# Altium project LED.PrjPCB
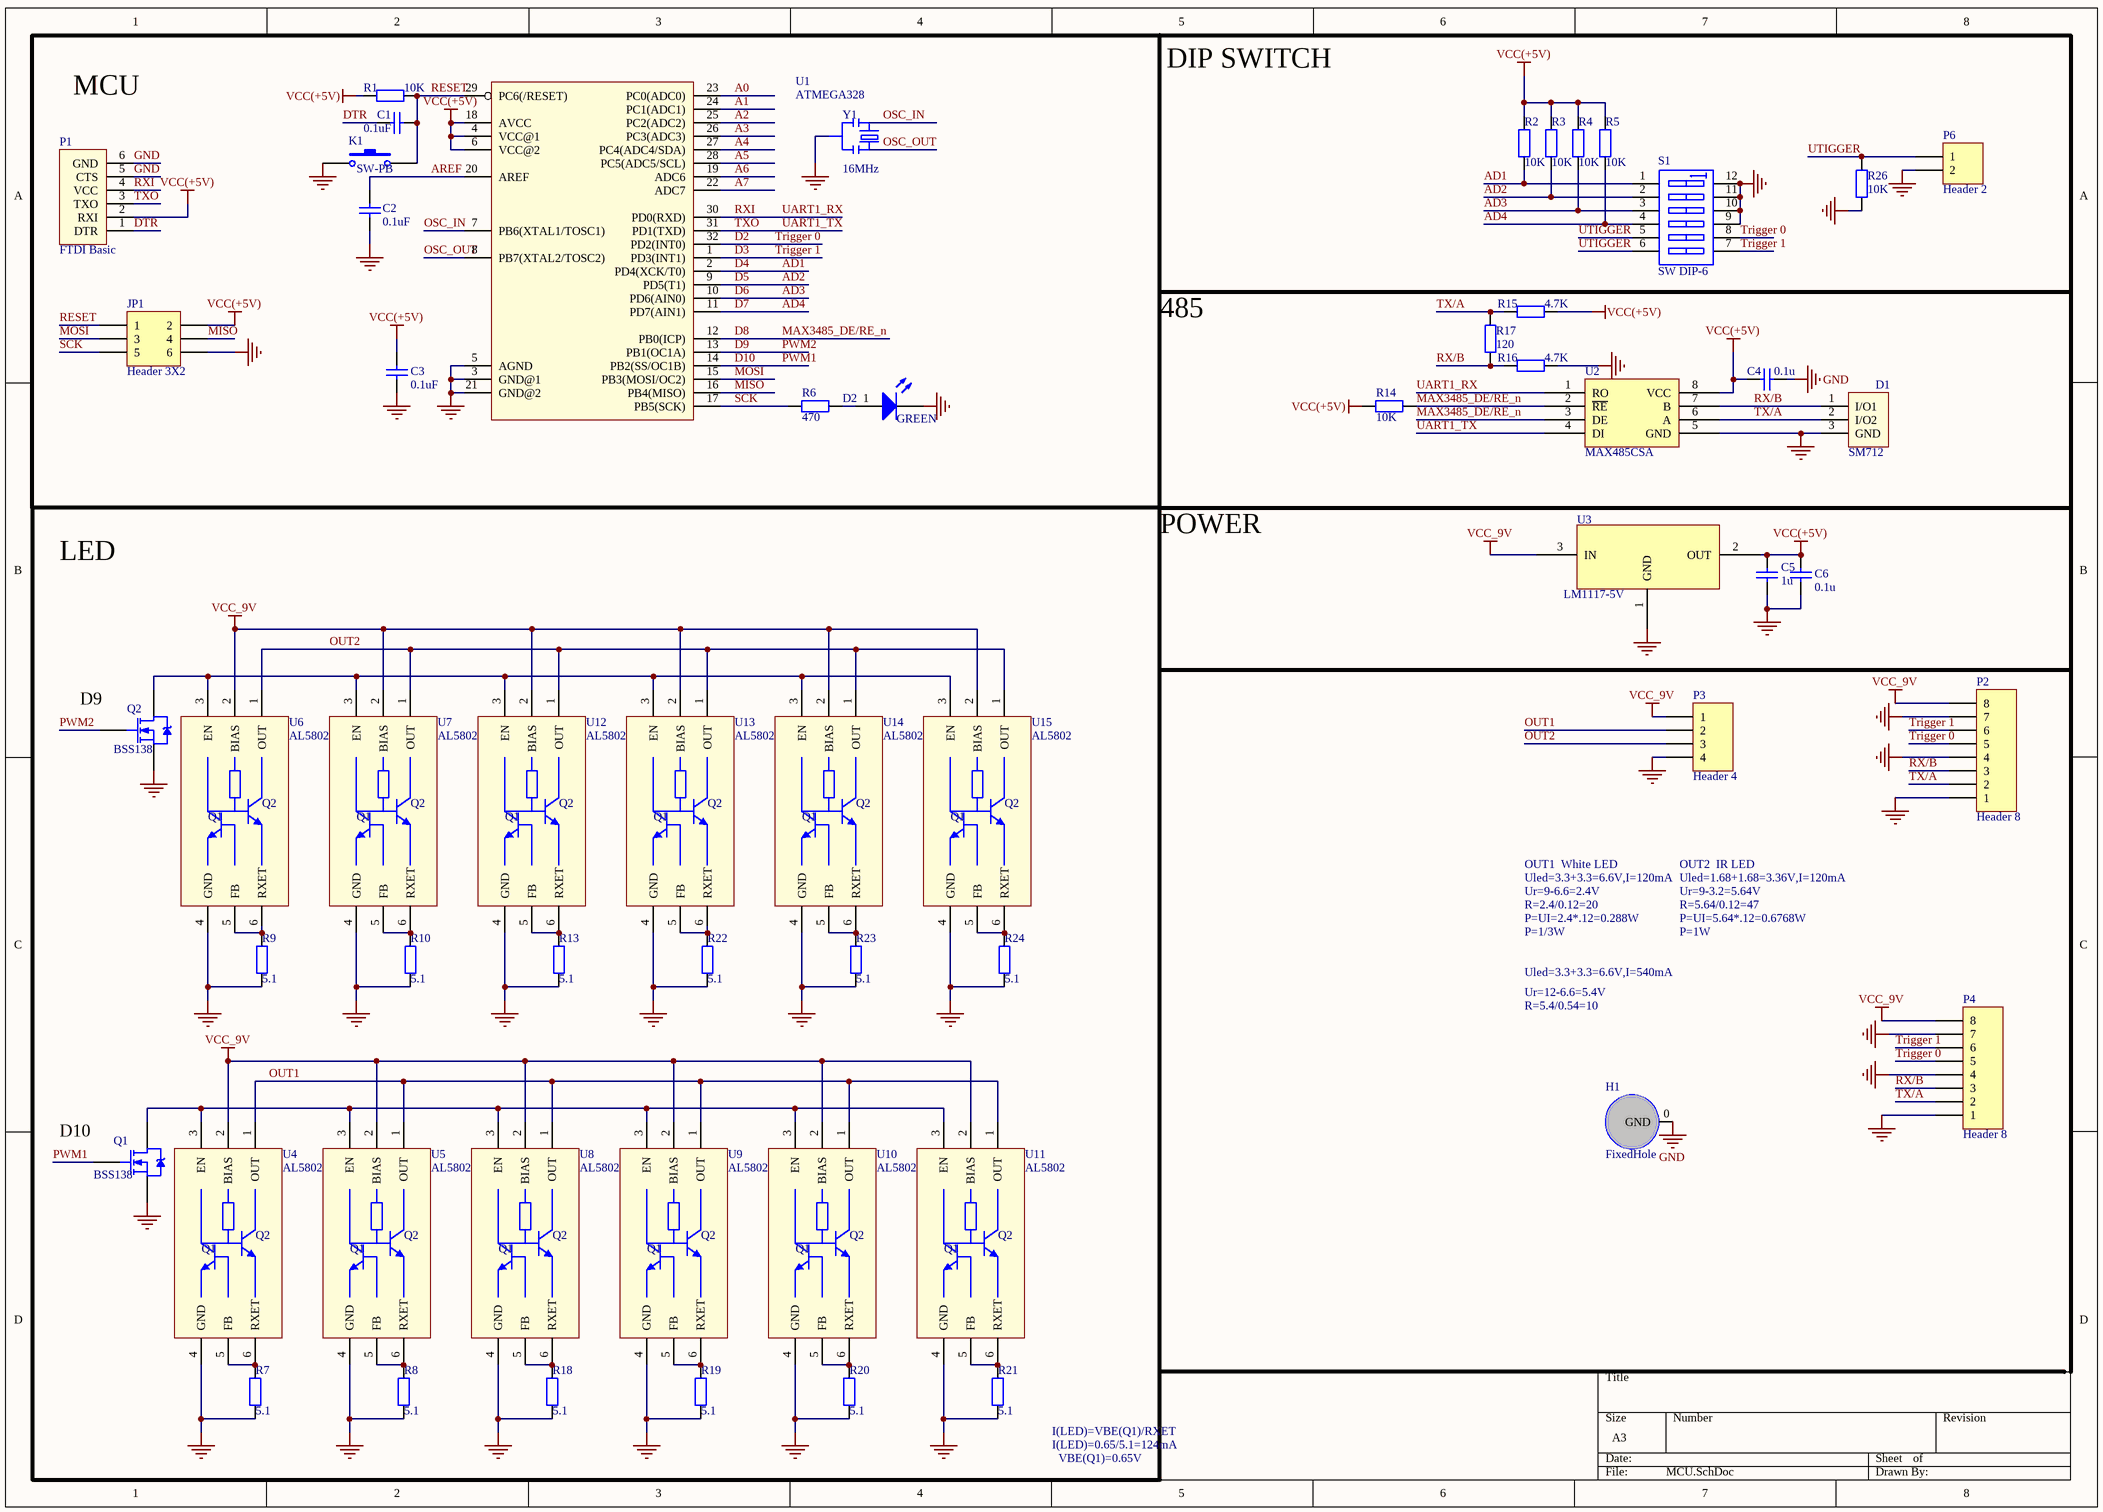
[diagram p0: MCU.SchDoc]
2 sheets, 63 parts. Net scope: global (net labels, ports and power ports of the same name join across sheets).
Board file: UC-428.pcbdoc
Sheets:
  MCU.SchDoc
  connect.SchDoc

## Sheet MCU.SchDoc
size A3

### Parts
C1  0.1uF  [C0603]
C2  0.1uF  [C0603]
C3  0.1uF  [C0603]
C4  0.1u  [C0603]
C5  1u  [C0603]
C6  0.1u  [C0603]
D1  SM712  [SOT23-3]
D2  GREEN  [LED0805]
H1  FixedHole  [固定孔_1]
JP1  Header 3X2  [MHDR1X6]
K1  SW-PB  [157SW]
P1  FTDI Basic  [MHDR1X6]
P2  Header 8  [SH_1.25MM*8]
P3  Header 4  [SMT_1.25MM*4]
P4  Header 8  [SH_1.25MM*8]
P6  Header 2  [HDR1X2]
Q1  BSS138  [SOT-23 (Standard)]
Q2  BSS138  [SOT-23 (Standard)]
R1  10K  [R0603]
R2  10K  [R0603]
R3  10K  [R0603]
R4  10K  [R0603]
R5  10K  [R0603]
R6  470  [R0603]
R7  5.1  [R0603]
R8  5.1  [R0603]
R9  5.1  [R0603]
R10  5.1  [R0603]
R13  5.1  [R0603]
R14  10K  [R0603]
R15  4.7K  [R0603]
R16  4.7K  [R0603]
R17  120  [R0603]
R18  5.1  [R0603]
R19  5.1  [R0603]
R20  5.1  [R0603]
R21  5.1  [R0603]
R22  5.1  [R0603]
R23  5.1  [R0603]
R24  5.1  [R0603]
R26  10K  [R0603]
S1  SW DIP-6  [DIP_SW_6WAY_SMD]
U1  ATMEGA328  [TQFP32-08]
U2  MAX485CSA  [SOIC-8]
U3  LM1117-5V  [SOT-223]
U4  AL5802  [SOT26]
U5  AL5802  [SOT26]
U6  AL5802  [SOT26]
U7  AL5802  [SOT26]
U8  AL5802  [SOT26]
U9  AL5802  [SOT26]
U10  AL5802  [SOT26]
U11  AL5802  [SOT26]
U12  AL5802  [SOT26]
U13  AL5802  [SOT26]
U14  AL5802  [SOT26]
U15  AL5802  [SOT26]
Y1  16MHz  [RESONATOR-SMD]

### Blocks framed on the sheet
LED: Q1 Q2 R7-R10 R13 R18-R24 U4-U15

### Nets
GND: C2.1 C3.2 C4.1 C5.1 C6.2 D1.3(GND) D2.2(K) H1.0(GND) JP1.6 K1.1 P1.5(CTS) P1.6(GND) P2.1 P2.4 P2.7 P3.4 P4.1 P4.4 P4.7 P6.2 Q1.S Q2.S R7.2 R8.2 R9.2 R10.2 R13.2 R16.1 R18.2 R19.2 R20.2 R21.2 R22.2 R23.2 R24.2 R26.1 S1.9(B4) S1.10(B3) S1.11(B2) S1.12(B1) U1.3(GND@1) U1.5(AGND) U1.21(GND@2) U2.5(GND) U3.1(GND) U4.4(GND) U5.4(GND) U6.4(GND) U7.4(GND) U8.4(GND) U9.4(GND) U10.4(GND) U11.4(GND) U12.4(GND) U13.4(GND) U14.4(GND) U15.4(GND) Y1.2
VCC(+5V): C3.1 C4.2 C5.2 C6.1 JP1.2 P1.2(RXI) R1.1 R2.1 R3.1 R4.1 R5.1 R14.2 R15.1 U1.4(VCC@1) U1.6(VCC@2) U1.18(AVCC) U2.8(VCC) U3.2(OUT)
VCC_9V: P2.8 P3.1 P4.8 U3.3(IN) U4.2(BIAS) U5.2(BIAS) U6.2(BIAS) U7.2(BIAS) U8.2(BIAS) U9.2(BIAS) U10.2(BIAS) U11.2(BIAS) U12.2(BIAS) U13.2(BIAS) U14.2(BIAS) U15.2(BIAS)
A0: U1.23(PC0(ADC0))
A1: U1.24(PC1(ADC1))
A2: U1.25(PC2(ADC2))
A3: U1.26(PC3(ADC3))
A4: U1.27(PC4(ADC4/SDA))
A5: U1.28(PC5(ADC5/SCL))
A6: U1.19(ADC6)
A7: U1.22(ADC7)
AD1: R2.2 S1.1(A1) U1.2(PD4(XCK/T0))  [also labelled D4]
AD2: R3.2 S1.2(A2) U1.9(PD5(T1))  [also labelled D5]
AD3: R4.2 S1.3(A3) U1.10(PD6(AIN0))  [also labelled D6]
AD4: R5.2 S1.4(A4) U1.11(PD7(AIN1))  [also labelled D7]
AREF: C2.2 U1.20(AREF)
D2: P2.5 P4.5 S1.8(B5) U1.32(PD2(INT0))  [also labelled Trigger 0]
D3: P2.6 P4.6 S1.7(B6) U1.1(PD3(INT1))  [also labelled Trigger 1]
D8: R14.1 U1.12(PB0(ICP)) U2.2(~{RE}) U2.3(DE)  [also labelled MAX3485_DE/RE_n]
D9: Q2.G U1.13(PB1(OC1A))  [also labelled PWM2]
D10: Q1.G U1.14(PB2(SS/OC1B))  [also labelled PWM1]
DTR: C1.1 P1.1(DTR)
MISO: JP1.4 U1.16(PB4(MISO))
MOSI: JP1.3 U1.15(PB3(MOSI/OC2))
OSC_IN: U1.7(PB6(XTAL1/TOSC1)) Y1.3
OSC_OUT: U1.8(PB7(XTAL2/TOSC2)) Y1.1
OUT1: P3.2 U4.1(OUT) U5.1(OUT) U8.1(OUT) U9.1(OUT) U10.1(OUT) U11.1(OUT)
OUT2: P3.3 U6.1(OUT) U7.1(OUT) U12.1(OUT) U13.1(OUT) U14.1(OUT) U15.1(OUT)
RESET: C1.2 JP1.1 K1.2 R1.2 U1.29(PC6(/RESET))
RX/B: D1.1(I/O1) P2.3 P4.3 R16.2 R17.2 U2.7(B)
RXI: P1.4(VCC) U1.30(PD0(RXD)) U2.1(RO)  [also labelled UART1_RX]
SCK: JP1.5 R6.1 U1.17(PB5(SCK))
TX/A: D1.2(I/O2) P2.2 P4.2 R15.2 R17.1 U2.6(A)
TXO: P1.3(TXO) U1.31(PD1(TXD)) U2.4(DI)  [also labelled UART1_TX]
UTIGGER: P6.1 R26.2 S1.5(A5) S1.6(A6)
NetD2_1: D2.1(A) R6.2
NetQ1_D: Q1.D U4.3(EN) U5.3(EN) U8.3(EN) U9.3(EN) U10.3(EN) U11.3(EN)
NetQ2_D: Q2.D U6.3(EN) U7.3(EN) U12.3(EN) U13.3(EN) U14.3(EN) U15.3(EN)
NetR7_1: R7.1 U4.5(FB) U4.6(RXET)
NetR8_1: R8.1 U5.5(FB) U5.6(RXET)
NetR9_1: R9.1 U6.5(FB) U6.6(RXET)
NetR10_1: R10.1 U7.5(FB) U7.6(RXET)
NetR13_1: R13.1 U12.5(FB) U12.6(RXET)
NetR18_1: R18.1 U8.5(FB) U8.6(RXET)
NetR19_1: R19.1 U9.5(FB) U9.6(RXET)
NetR20_1: R20.1 U10.5(FB) U10.6(RXET)
NetR21_1: R21.1 U11.5(FB) U11.6(RXET)
NetR22_1: R22.1 U13.5(FB) U13.6(RXET)
NetR23_1: R23.1 U14.5(FB) U14.6(RXET)
NetR24_1: R24.1 U15.5(FB) U15.6(RXET)

### Notes on the sheet
- MCU
- DIP SWITCH
- 485
- POWER
- (near Q2) D9
- Uled=3.3+3.3=6.6V,I=120mA
- OUT1  White LED
- R=2.4/0.12=20
- P=UI=2.4*.12=0.288W
- Ur=9-6.6=2.4V
- Uled=1.68+1.68=3.36V,I=120mA
- OUT2  IR LED
- R=5.64/0.12=47
- P=UI=5.64*.12=0.6768W
- Ur=9-3.2=5.64V
- P=1/3W
- Uled=3.3+3.3=6.6V,I=540mA
- Ur=12-6.6=5.4V
- P=1W
- R=5.4/0.54=10
- (near Q1) D10
- I(LED)=VBE(Q1)/RXET
- I(LED)=0.65/5.1=124mA
- VBE(Q1)=0.65V
- (in symbol AL5802) Q2; Q1

### Library data of the parts
C1-C3 = CAP SMT C100nF25V10%X7R: Capacitor; Voltage: 25V; iPartNumber: C100nF25V10%X7R; Value: 0.1uF
C4 = Cap: Capacitor; Value: 100pF; Published: 8-Jun-2000; LatestRevisionDate: 17-Jul-2002; LatestRevisionNote: Re-released for DXP Platform.; PackageReference: RAD-0.3; Publisher: Altium Limited
C5 = Cap: 50V/8.2u/0805; Value: 100n; Published: 8-Jun-2000; LatestRevisionDate: 17-Jul-2002; LatestRevisionNote: Re-released for DXP Platform.; PackageReference: RAD-0.3; Publisher: Altium Limited
C6 = CAP0805: Capacitor; Value: 104; Published: 8-Jun-2000; Revision: July-2002: Re-released for DXP Platform.; Publisher: Altium Limited
D2 = LED0: Typical INFRARED GaAs LED; Published: 8-Jun-2000; LatestRevisionDate: 08-Jul-2005; LatestRevisionNote: Mech Layer 1 removed.; PackageReference: LED-0; Publisher: Altium Limited
H1 = 固定孔
JP1 = Header 3X2: Header, 3-Pin, Dual row; LatestRevisionDate: 17-Jul-2002; LatestRevisionNote: Re-released for DXP Platform.; Publisher: Altium Limited
K1 = SW-PB: Switch; Published: 24-Mar-1999; LatestRevisionDate: 17-Jul-2002; LatestRevisionNote: Re-released for DXP Platform.; PackageReference: SPST-2; Publisher: Altium Limited; PackageDescription: Switch; 2 Leads
P1 = ARDUINO_SERIAL_PROGRAMPTH
P2 P4 = Header 8: Header, 8-Pin; LatestRevisionDate: 17-Jul-2002; LatestRevisionNote: Re-released for DXP Platform.; Publisher: Altium Limited
P3 = Header 4: Header, 4-Pin; LatestRevisionDate: 17-Jul-2002; LatestRevisionNote: Re-released for DXP Platform.; Publisher: Altium Limited
P6 = Header 2: Header, 2-Pin; LatestRevisionDate: 17-Jul-2002; LatestRevisionNote: Re-released for DXP Platform.; Publisher: Altium Limited
Q1 Q2 = NMOS: Manufacturer: Fairchild Semiconductor; Manufacturer Part Number: BSS123; FET Type: MOSFET N-Channel, Metal Oxide; FET Feature: Logic Level Gate; Drain to Source Voltage (Vdss): 100V; Current - Continuous Drain (Id) @ 25°C: 170mA (Ta); Rds On (Max) @ Id, Vgs: 6 Ohm @ 170mA, 10V; Vgs(th) (Max) @ Id: 2V @ 1mA; Gate Charge (Qg) @ Vgs: 2.5nC @ 10V; Input Capacitance (Ciss) @ Vds: 73pF @ 25V; Power - Max: 360mW; Supplier 1: Digi-Key; Supplier Part Number 1: BSS123NCT-ND; RoHS: RoHS Compliant; Category: Discrete Semiconductor Products; Stock 1: 163946; Pricing 1: 1=0.24, 10=0.216, 25=0.1556, 100=0.1211, 250=0.07612, 500=0.06484, 1000=0.04418 (USD); Packaging: Cut Tape (CT); Mounting Type: Surface Mount; Package / Case: TO-236-3, SC-59, SOT-23-3; Supplier Device Package: SOT-23; ComponentLink1URL: http://www.fairchildsemi.com/datasheets/BS/BSS123.pdf; ComponentLink1Description: http://www.fairchildsemi.com/datasheets/BS/BSS123.pdf
R1-R10 R13-R24 = Res2: Resistor
R26 = Res2: Resistor; Value: 1k; Published: 8-Jun-2000; LatestRevisionDate: 17-Jul-2002; LatestRevisionNote: Re-released for DXP Platform.; PackageReference: AXIAL-0.4; Publisher: Altium Limited
S1 = SW DIP-6: DIP Switch, 6 Position, SPST; Published: 24-Mar-1999; LatestRevisionDate: 17-Jul-2002; LatestRevisionNote: Re-released for DXP Platform.; PackageReference: DIP-12/SW; Publisher: Altium Limited
U1 = ATMEGA168
U2 = MAX3485CSA
U3 = AMS1117
Y1 = RESONATORSMD

## Sheet connect.SchDoc
size A4
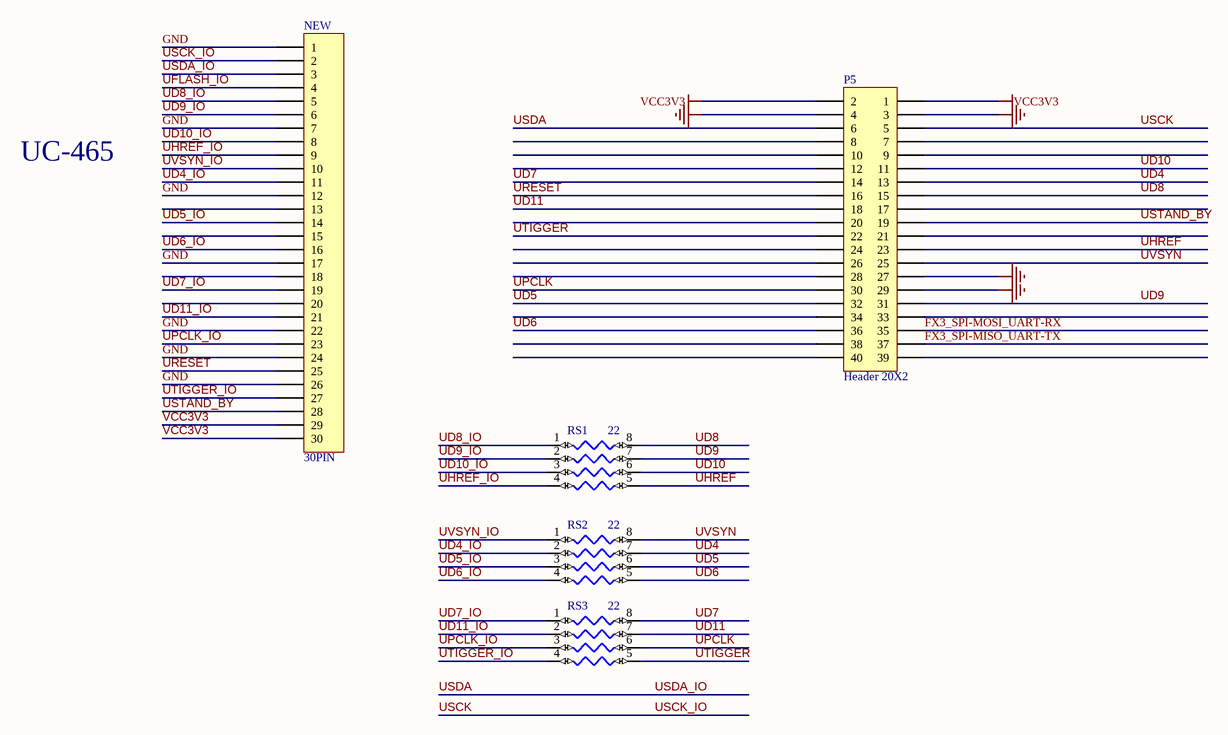
[diagram p1: connect.SchDoc]

### Parts
NEW  30PIN  [FH12-30S-0.5SH]
P5  Header 20X2  [1.27MM 2*20]
RS1  22  [NC06-4]
RS2  22  [NC06-4]
RS3  22  [NC06-4]

### Nets
GND: NEW.1 NEW.7 NEW.12 NEW.17 NEW.22 NEW.24 NEW.26 P5.3 P5.4 P5.27 P5.29
VCC3V3: NEW.29 NEW.30 P5.1 P5.2
FX3_SPI-MISO_UART-TX: P5.37
FX3_SPI-MOSI_UART-RX: P5.35
UD4: P5.13 RS2.7
UD4_IO: NEW.11 RS2.2
UD5: P5.32 RS2.6
UD5_IO: NEW.14 RS2.3
UD6: P5.36 RS2.5
UD6_IO: NEW.16 RS2.4
UD7: P5.14 RS3.8
UD7_IO: NEW.19 RS3.1
UD8: P5.15 RS1.8
UD8_IO: NEW.5 RS1.1
UD9: P5.31 RS1.7
UD9_IO: NEW.6 RS1.2
UD10: P5.11 RS1.6
UD10_IO: NEW.8 RS1.3
UD11: P5.18 RS3.7
UD11_IO: NEW.21 RS3.2
UFLASH_IO: NEW.4
UHREF: P5.23 RS1.5
UHREF_IO: NEW.9 RS1.4
UPCLK: P5.30 RS3.6
UPCLK_IO: NEW.23 RS3.3
URESET: NEW.25 P5.16
USCK: NEW.2 P5.5  [also labelled USCK_IO]
USDA: NEW.3 P5.6  [also labelled USDA_IO]
USTAND_BY: NEW.28 P5.19
UTIGGER: P5.22 RS3.5
UTIGGER_IO: NEW.27 RS3.4
UVSYN: P5.25 RS2.8
UVSYN_IO: NEW.10 RS2.1

Not connected (* = marked no-connect by the designer): NEW 13 15 18 20; P5 7 8 9 10 12 17 20 21 24 26 28 33 34 38 39 40

### Notes on the sheet
- UC-465

### Library data of the parts
NEW = Header 30: Header, 30-Pin; LatestRevisionDate: 17-Jul-2002; LatestRevisionNote: Re-released for DXP Platform.; Publisher: Altium Limited
P5 = Header 20X2: Header, 20-Pin, Dual row; LatestRevisionDate: 17-Jul-2002; LatestRevisionNote: Re-released for DXP Platform.; Publisher: Altium Limited
RS1-RS3 = RN4: Option 2 - Device: *; Option 2 - Spec: *; Option 3 - Device: *; Option 3 - Spec: *; Option 4 - Device: *; Option 4 - Spec: *; Option 5 - Device: *; Option 5 - Spec: *; Option 6 - Device: *; Option 6 - Spec: *; Option 7 - Device: *; Option 7 - Spec: *; Option 8 - Device: *; Option 8 - Spec: *

## Nets that join several sheets
GND: MCU (58 pins), connect (11 pins)
UTIGGER: MCU (P6.1 R26.2 S1.5 S1.6), connect (P5.22 RS3.5)